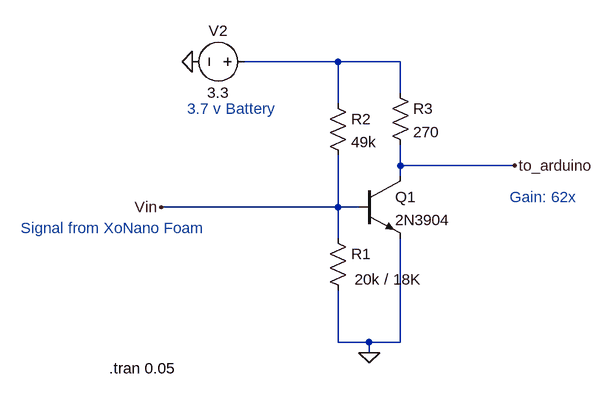
[diagram p0: schematic instructional_circuit.asc]
instructional_circuit.asc, the LTspice schematic file:
Version 4
SHEET 1 880 680
WIRE 128 0 -16 0
WIRE 224 0 128 0
WIRE 224 48 224 0
WIRE 128 64 128 0
WIRE 224 160 224 128
WIRE 400 160 224 160
WIRE 224 176 224 160
WIRE 128 224 128 144
WIRE 128 224 -144 224
WIRE 160 224 128 224
WIRE 128 272 128 224
WIRE 128 432 128 352
WIRE 176 432 128 432
WIRE 224 432 224 272
WIRE 224 432 176 432
WIRE 176 448 176 432
FLAG 176 448 0
FLAG 400 160 to_arduino
FLAG -96 0 0
FLAG -144 224 Vin
SYMBOL npn 160 176 R0
SYMATTR InstName Q1
SYMATTR Value 2N3904
SYMBOL res 112 256 R0
WINDOW 3 42 79 Left 2
SYMATTR InstName R1
SYMATTR Value 20k / 18K
SYMBOL res 112 48 R0
SYMATTR InstName R2
SYMATTR Value 49k
SYMBOL res 208 32 R0
SYMATTR InstName R3
SYMATTR Value 270
SYMBOL voltage 0 0 R90
WINDOW 0 -32 56 VBottom 2
WINDOW 3 32 56 VTop 2
WINDOW 123 0 0 Left 0
WINDOW 39 0 0 Left 0
SYMATTR InstName V2
SYMATTR Value 3.3
TEXT -104 72 Left 2 ;3.7 v Battery
TEXT -360 256 Left 2 ;Signal from XoNano Foam
TEXT -224 472 Left 2 !.tran 0.05
TEXT 392 208 Left 2 ;Gain: 62x

The netlist it stands for:
* instructional_circuit.asc
Q1 to_arduino Vin 0 0 2N3904
R1 Vin 0 20k / 18K
R2 N001 Vin 49k
R3 N001 to_arduino 270
V2 N001 0 3.3
.model NPN NPN
.model PNP PNP
.lib standard.bjt
* 3.7 v Battery
* Signal from XoNano Foam
.tran 0.05
* Gain: 62x
.backanno
.end